# Altium schematic sheet 02_IO.SchDoc
size A3
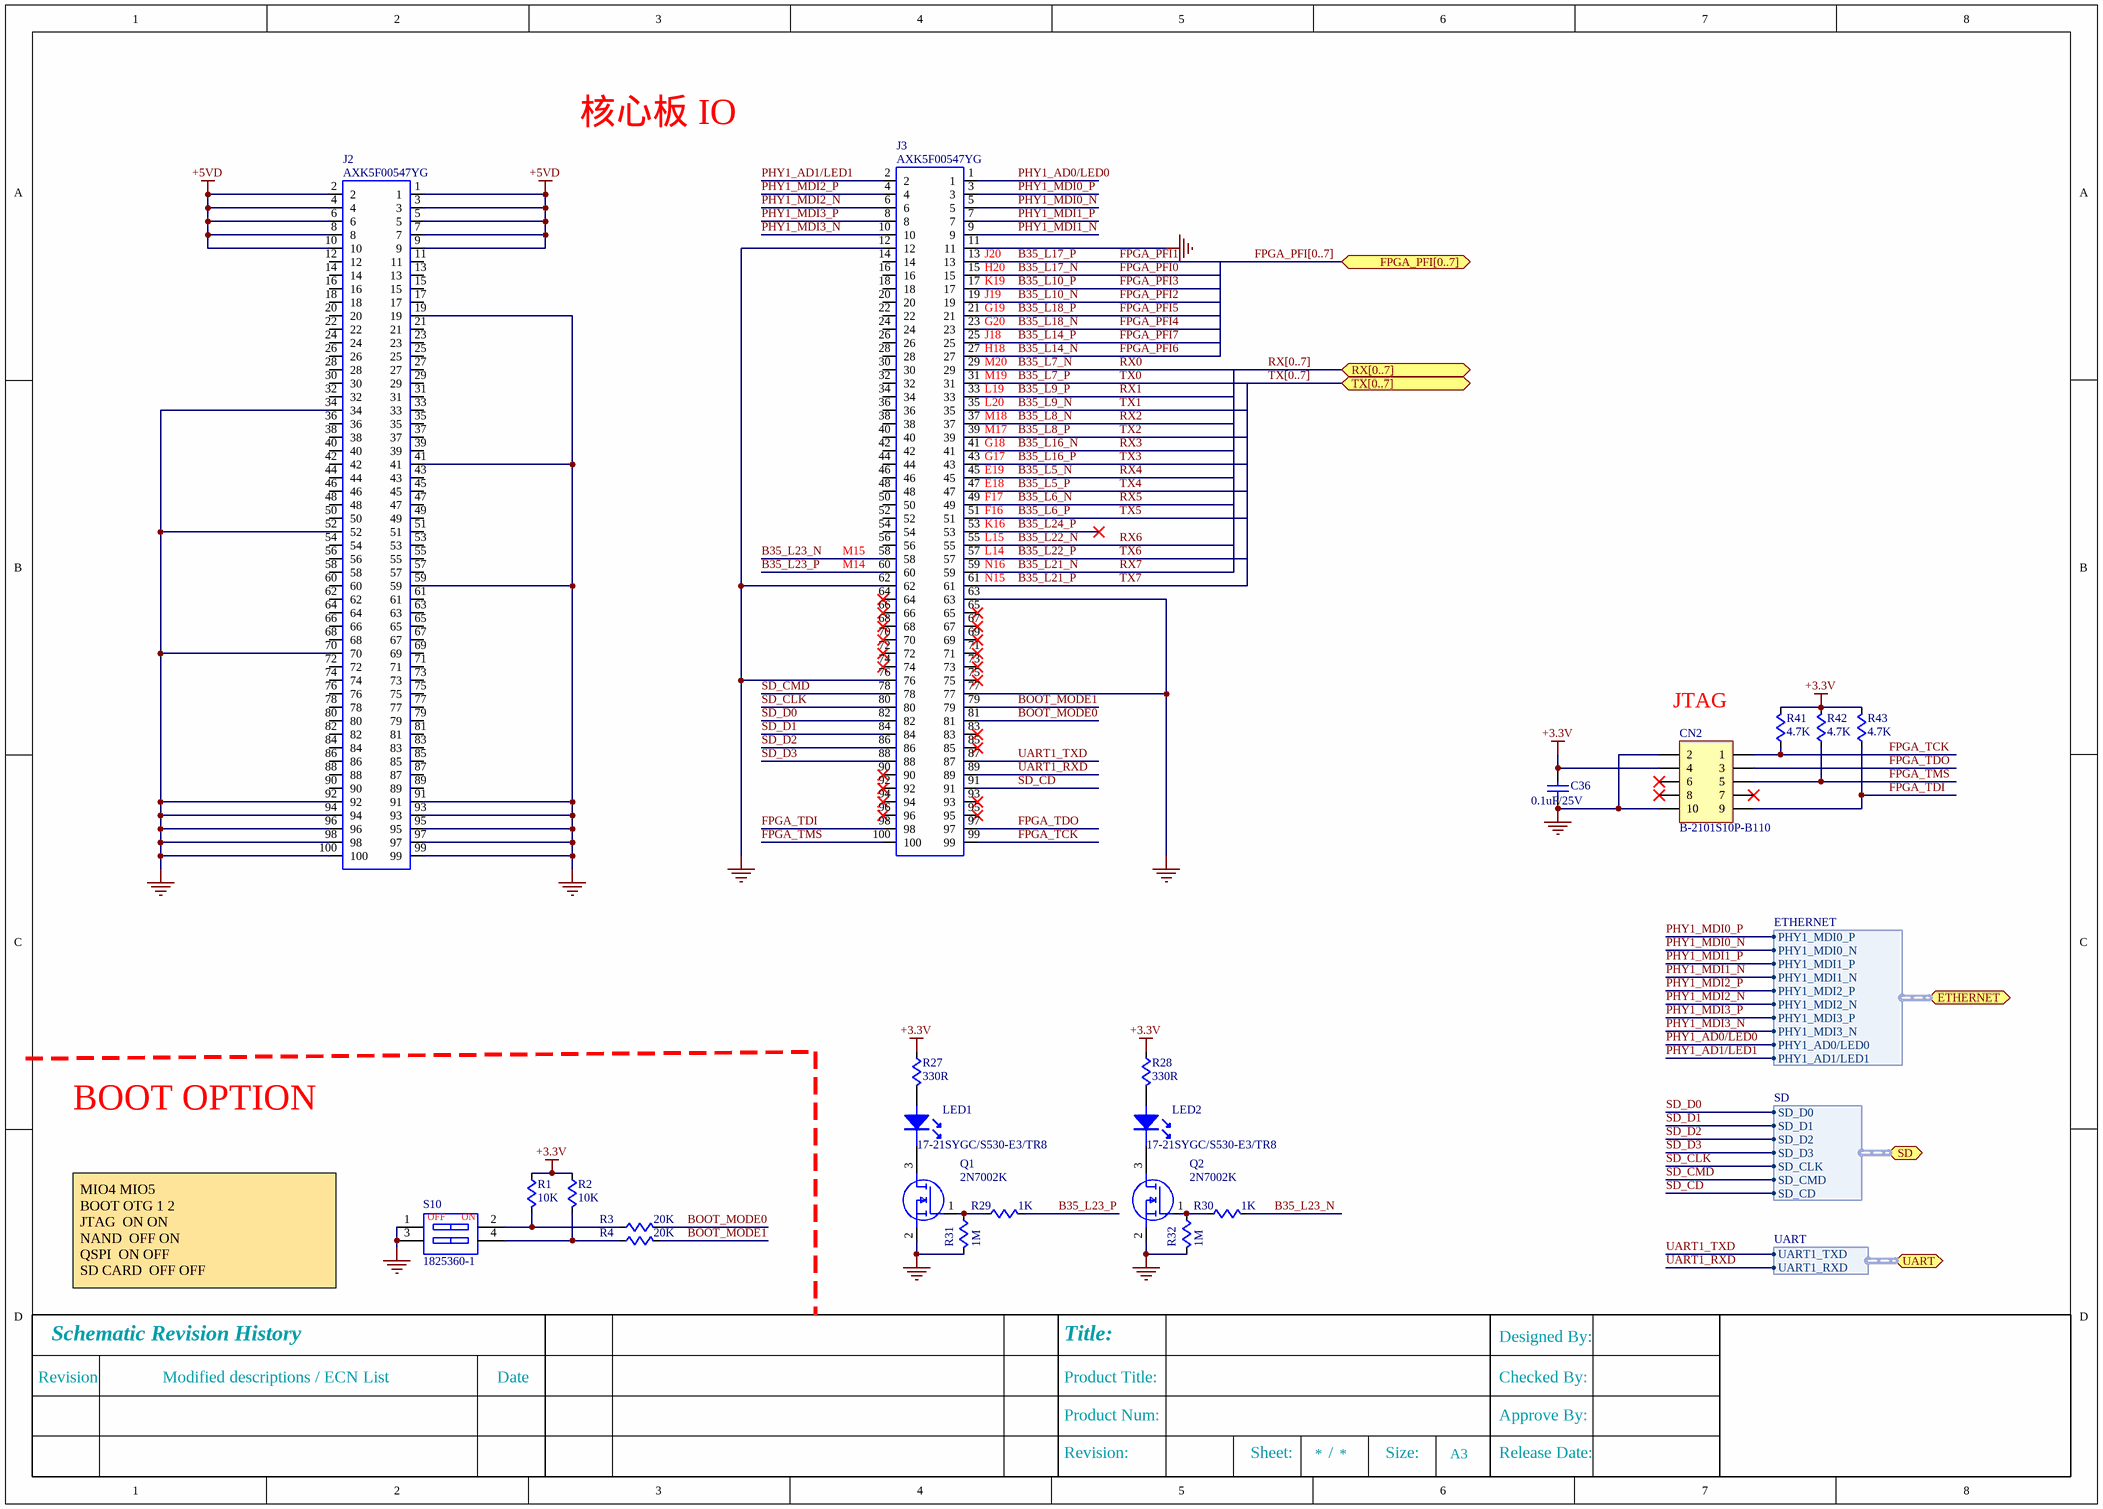
[diagram p0: 02_IO.SchDoc]

## Parts
C36  0.1uF/25V  [C0603]
CN2  B-2101S10P-B110  [SHF10501FDTH]
J2  AXK5F00547YG  [AXK5F00547YG]
J3  AXK5F00547YG  [AXK5F00547YG]
LED1  17-21SYGC/S530-E3/TR8  [LED_0805]
LED2  17-21SYGC/S530-E3/TR8  [LED_0805]
Q1  2N7002K  [SOT95P240X120-3N]
Q2  2N7002K  [SOT95P240X120-3N]
R1  10K  [R0603]
R2  10K  [R0603]
R3  20K  [R0603]
R4  20K  [R0603]
R27  330R  [R0603]
R28  330R  [R0603]
R29  1K  [R0603]
R30  1K  [R0603]
R31  1M  [R0603]
R32  1M  [R0603]
R41  4.7K  [R0603]
R42  4.7K  [R0603]
R43  4.7K  [R0603]
S10  1825360-1  [18253601]

## Ports
ETHERNET (bidir, harness ETHERNET), FPGA_PFI[0..7] (bidir), RX[0..7] (bidir), SD (bidir, harness SD), TX[0..7] (bidir), UART (bidir, harness UART)

## Harnesses
SD: SD_D0, SD_D1, SD_D2, SD_D3, SD_CLK, SD_CMD, SD_CD
UART: UART1_TXD, UART1_RXD
ETHERNET: PHY1_MDI0_P, PHY1_MDI0_N, PHY1_MDI1_P, PHY1_MDI1_N, PHY1_MDI2_P, PHY1_MDI2_N, PHY1_MDI3_P, PHY1_MDI3_N, PHY1_AD0/LED0, PHY1_AD1/LED1

## Nets
+3.3V: C36.1 CN2.4 R1.1 R2.1 R27.1 R28.1 R41.2 R42.2 R43.2
+5VD: J2.1 J2.2 J2.3 J2.4 J2.5 J2.6 J2.7 J2.8 J2.9 J2.10
GND: C36.2 CN2.2 CN2.10 J2.19 J2.34 J2.41 J2.52 J2.59 J2.70 J2.91 J2.92 J2.93 J2.94 J2.95 J2.96 J2.97 J2.98 J2.99 J2.100 J3.11 J3.12 J3.62 J3.63 J3.76 J3.77 Q1.2(S) Q2.2(S) R31.2 R32.2 S10.1 S10.3
B35_L5_N: J3.45  [also labelled RX4]
B35_L5_P: J3.47  [also labelled TX4]
B35_L6_N: J3.49  [also labelled RX5]
B35_L6_P: J3.51  [also labelled TX5]
B35_L7_N: J3.29  [also labelled RX0]
B35_L7_P: J3.31  [also labelled TX0]
B35_L8_N: J3.37  [also labelled RX2]
B35_L8_P: J3.39  [also labelled TX2]
B35_L9_N: J3.35  [also labelled TX1]
B35_L9_P: J3.33  [also labelled RX1]
B35_L10_N: J3.19  [also labelled FPGA_PFI2]
B35_L10_P: J3.17  [also labelled FPGA_PFI3]
B35_L14_N: J3.27  [also labelled FPGA_PFI6]
B35_L14_P: J3.25  [also labelled FPGA_PFI7]
B35_L16_N: J3.41  [also labelled RX3]
B35_L16_P: J3.43  [also labelled TX3]
B35_L17_N: J3.15  [also labelled FPGA_PFI0]
B35_L17_P: J3.13  [also labelled FPGA_PFI1]
B35_L18_N: J3.23  [also labelled FPGA_PFI4]
B35_L18_P: J3.21  [also labelled FPGA_PFI5]
B35_L21_N: J3.59  [also labelled RX7]
B35_L21_P: J3.61  [also labelled TX7]
B35_L22_N: J3.55  [also labelled RX6]
B35_L22_P: J3.57  [also labelled TX6]
B35_L23_N: J3.58 R30.2
B35_L23_P: J3.60 R29.2
B35_L24_P: J3.53
BOOT_MODE0: J3.81 R3.2
BOOT_MODE1: J3.79 R4.2
FPGA_TCK: CN2.1 J3.99 R41.1
FPGA_TDI: CN2.9 J3.98 R43.1
FPGA_TDO: CN2.3 J3.97
FPGA_TMS: CN2.5 J3.100 R42.1
PHY1_AD0/LED0: J3.1 ; port ETHERNET.PHY1_AD0/LED0
PHY1_AD1/LED1: J3.2 ; port ETHERNET.PHY1_AD1/LED1
PHY1_MDI0_N: J3.5 ; port ETHERNET.PHY1_MDI0_N
PHY1_MDI0_P: J3.3 ; port ETHERNET.PHY1_MDI0_P
PHY1_MDI1_N: J3.9 ; port ETHERNET.PHY1_MDI1_N
PHY1_MDI1_P: J3.7 ; port ETHERNET.PHY1_MDI1_P
PHY1_MDI2_N: J3.6 ; port ETHERNET.PHY1_MDI2_N
PHY1_MDI2_P: J3.4 ; port ETHERNET.PHY1_MDI2_P
PHY1_MDI3_N: J3.10 ; port ETHERNET.PHY1_MDI3_N
PHY1_MDI3_P: J3.8 ; port ETHERNET.PHY1_MDI3_P
SD_CD: J3.91 ; port SD.SD_CD
SD_CLK: J3.80 ; port SD.SD_CLK
SD_CMD: J3.78 ; port SD.SD_CMD
SD_D0: J3.82 ; port SD.SD_D0
SD_D1: J3.84 ; port SD.SD_D1
SD_D2: J3.86 ; port SD.SD_D2
SD_D3: J3.88 ; port SD.SD_D3
UART1_RXD: J3.89 ; port UART.UART1_RXD
UART1_TXD: J3.87 ; port UART.UART1_TXD
NetLED1_A: LED1.A R27.2
NetLED1_K: LED1.K Q1.3(D)
NetLED2_A: LED2.A R28.2
NetLED2_K: LED2.K Q2.3(D)
NetQ1_1: Q1.1(G) R29.1 R31.1
NetQ2_1: Q2.1(G) R30.1 R32.1
NetR1_2: R1.2 R3.1 S10.2
NetR2_2: R2.2 R4.1 S10.4

Not connected (* = marked no-connect by the designer): CN2 6* 7* 8*; J2 11 12 13 14 15 16 17 18 20 21 22 23 24 25 26 27 28 29 30 31 32 33 35 36 37 38 39 40 42 43 44 45 46 47 48 49 50 51 53 54 55 56 57 58 60 61 62 63 64 65 66 67 68 69 71 72 73 74 75 76 77 78 79 80 81 82 83 84 85 86 87 88 89 90; J3 14 16 18 20 22 24 26 28 30 32 34 36 38 40 42 44 46 48 50 52 54 56 64* 65* 66* 67* 68* 69* 70* 71* 72* 73* 74* 75* 83* 85* 90* 92* 93* 94* 95* 96*

## Buses and harness runs
bus FPGA_PFI[0..7] = port FPGA_PFI[0..7]
bus RX[0..7] = port RX[0..7]
bus TX[0..7] = port TX[0..7]

## Notes on the sheet
- 核心板 IO
- (near J3) G19
- (near J3) J19
- (near J3) J20
- (near J3) H20
- (near J3) K19
- (near J3) M19
- (near J3) M20
- (near J3) H18
- (near J3) J18
- (near J3) G20
- (near J3) G18
- (near J3) M17
- (near J3) M18
- (near J3) L20
- (near J3) L19
- (near J3) F16
- (near J3) F17
- (near J3) E18
- (near J3) E19
- (near J3) G17
- (near J3) M15
- (near J3) M14
- (near J3) N15
- (near J3) N16
- (near J3) L14
- (near J3) L15
- (near J3) K16
- JTAG
- BOOT OPTION
- MIO4	MIO5
  BOOT OTG	1	2
  JTAG		ON	ON
  NAND		OFF	ON
  QSPI		ON	OFF
  SD CARD		OFF	OFF
- Revision
- Schematic Revision History
- Modified descriptions / ECN List
- Date
- Product Title:
- Title:
- Checked By:
- Designed By:
- Revision:
- Product Num:
- Sheet:
- /
- Size:
- A3
- Approve By:
- Release Date:
- Title
- Date:
- Number:
- Time:
- Sheet
- of
- File:
- (in symbol 1825360-1) OFF; ON

## Library data of the parts
C36 = C: MLCC
CN2 = Header 5X2: 5*2P接插件,间距1.27mm,参考链接：https://so.szlcsc.com/global.html?k=B-2101S10P-B110&hot-key=LM358; 版权归属: 源创客; BOM名称: 5*2P接插件; 学习资源: www.ooocke.com
J2 J3 = Header_2X50: Header_2X50_0.5mm; PCB Footprint: H0_8X2X50_B
LED1 LED2 = LED: U_TABLE: U_113
Q1 Q2 = 2N7002K: MOSFET (N-Channel); Manufacturer_Name: onsemi; Datasheet Link: https://componentsearchengine.com/Datasheets/2/2N7002K.pdf; Height: 1.2mm; Manufacturer_Part_Number: 2N7002K; Mouser Part Number: 512-2N7002K; Mouser Price/Stock: https://www.mouser.co.uk/ProductDetail/onsemi-Fairchild/2N7002K?qs=iS%252BvaFGfLorx0keKeEIrfg%3D%3D; Arrow Part Number: 2N7002K; Arrow Price/Stock: https://www.arrow.com/en/products/2n7002k/on-semiconductor?region=europe
R1-R4 R27-R32 R41-R43 = R: 贴片电阻
S10 = 1825360-1: Switch; Manufacturer_Name: TE Connectivity; Datasheet Link: https://www.te.com/commerce/DocumentDelivery/DDEController?Action=srchrtrv&DocNm=1825360&DocType=CD&DocLang=EN; Height: 5.8mm; Manufacturer_Part_Number: 1825360-1; Mouser Part Number: 655-1825360-1; Mouser Price/Stock: https://www.mouser.co.uk/ProductDetail/TE-Connectivity-PB/1825360-1?qs=Ftb%252BnBCDTZKCT4kLG1kHfw%3D%3D; Arrow Part Number: 1825360-1; Arrow Price/Stock: https://www.arrow.com/en/products/1825360-1/te-connectivity